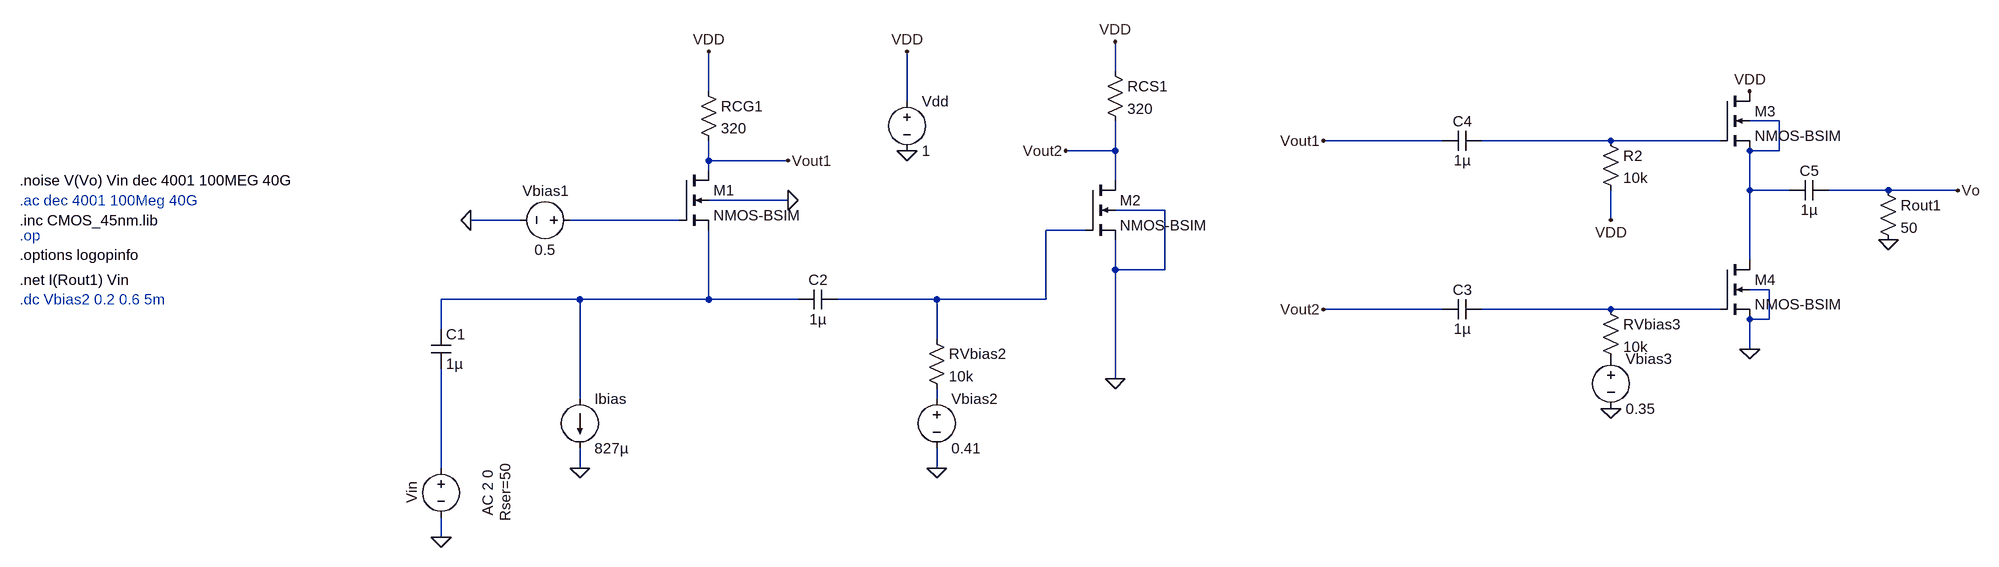
[diagram p0: schematic NMOS_45nm_N1.asc]
NMOS_45nm_N1.asc, the LTspice schematic file:
Version 4.1
SHEET 1 2016 680
WIRE 608 -224 608 -272
WIRE -48 -192 -48 -256
WIRE 272 -176 272 -256
WIRE 1680 -144 1632 -144
WIRE 1136 -112 944 -112
WIRE 1408 -112 1200 -112
WIRE 1584 -112 1408 -112
WIRE 608 -96 608 -144
WIRE 608 -96 528 -96
WIRE 1680 -96 1680 -144
WIRE 1680 -96 1632 -96
WIRE -48 -80 -48 -112
WIRE 80 -80 -48 -80
WIRE -48 -64 -48 -80
WIRE 608 -48 608 -96
WIRE 1632 -32 1632 -96
WIRE 1696 -32 1632 -32
WIRE 1856 -32 1760 -32
WIRE 1968 -32 1856 -32
WIRE 80 -16 -48 -16
WIRE 688 0 608 0
WIRE -352 16 -432 16
WIRE -96 16 -272 16
WIRE 1408 16 1408 -32
WIRE 560 32 496 32
WIRE 1632 80 1632 -32
WIRE 608 96 608 48
WIRE 688 96 688 0
WIRE 688 96 608 96
WIRE 1664 128 1632 128
WIRE -256 144 -480 144
WIRE -48 144 -48 32
WIRE -48 144 -256 144
WIRE 96 144 -48 144
WIRE 320 144 160 144
WIRE 496 144 496 32
WIRE 496 144 320 144
WIRE 1136 160 944 160
WIRE 1408 160 1200 160
WIRE 1584 160 1408 160
WIRE 1664 176 1664 128
WIRE 1664 176 1632 176
WIRE -480 192 -480 144
WIRE 320 208 320 144
WIRE 1632 224 1632 176
WIRE 608 272 608 96
WIRE -256 304 -256 144
WIRE 320 304 320 288
WIRE -480 416 -480 256
WIRE -256 416 -256 384
WIRE 320 416 320 384
WIRE -480 528 -480 496
FLAG -432 16 0
FLAG 272 -96 0
FLAG 272 -256 VDD
FLAG -48 -256 VDD
FLAG -256 416 0
FLAG 80 -16 0
FLAG -480 528 0
FLAG 80 -80 Vout1
FLAG 528 -96 Vout2
FLAG 608 272 0
FLAG 608 -272 VDD
FLAG 320 416 0
FLAG 1408 320 0
FLAG 1632 224 0
FLAG 1632 -192 VDD
FLAG 944 160 Vout2
FLAG 944 -112 Vout1
FLAG 1968 -32 Vo
FLAG 1856 48 0
FLAG 1408 16 VDD
SYMBOL voltage -256 16 R90
WINDOW 0 -32 56 VBottom 2
WINDOW 3 32 56 VTop 2
WINDOW 123 0 0 Left 0
WINDOW 39 0 0 Left 0
SYMATTR InstName Vbias1
SYMATTR Value 0.5
SYMBOL voltage 272 -192 R0
WINDOW 123 0 0 Left 0
WINDOW 39 0 0 Left 0
SYMATTR InstName Vdd
SYMATTR Value 1
SYMBOL res -64 -208 R0
SYMATTR InstName RCG1
SYMATTR Value 320
SYMBOL voltage -480 400 R0
WINDOW 0 -32 56 VBottom 2
WINDOW 3 32 56 VTop 2
WINDOW 123 60 56 VTop 2
WINDOW 39 88 56 VTop 2
SYMATTR InstName Vin
SYMATTR Value ""
SYMATTR Value2 AC 2 0
SYMATTR SpiceLine Rser=50
SYMBOL nmos4 -96 -64 R0
SYMATTR InstName M1
SYMATTR Value NMOS-BSIM
SYMATTR Value2 l=45n w=30u
SYMBOL current -256 304 R0
WINDOW 123 0 0 Left 0
WINDOW 39 0 0 Left 0
SYMATTR InstName Ibias
SYMATTR Value 827µ
SYMBOL cap -496 192 R0
SYMATTR InstName C1
SYMATTR Value 1µ
SYMBOL nmos4 560 -48 R0
SYMATTR InstName M2
SYMATTR Value NMOS-BSIM
SYMATTR Value2 l=45n w=30u
SYMBOL res 592 -240 R0
SYMATTR InstName RCS1
SYMATTR Value 320
SYMBOL cap 160 128 R90
WINDOW 0 0 32 VBottom 2
WINDOW 3 32 32 VTop 2
SYMATTR InstName C2
SYMATTR Value 1µ
SYMBOL voltage 320 288 R0
WINDOW 123 0 0 Left 0
WINDOW 39 0 0 Left 0
SYMATTR InstName Vbias2
SYMATTR Value 0.41
SYMBOL res 304 192 R0
SYMATTR InstName RVbias2
SYMATTR Value 10k
SYMBOL cap 1200 144 R90
WINDOW 0 0 32 VBottom 2
WINDOW 3 32 32 VTop 2
SYMATTR InstName C3
SYMATTR Value 1µ
SYMBOL cap 1200 -128 R90
WINDOW 0 0 32 VBottom 2
WINDOW 3 32 32 VTop 2
SYMATTR InstName C4
SYMATTR Value 1µ
SYMBOL res 1392 -128 R0
SYMATTR InstName R2
SYMATTR Value 10k
SYMBOL res 1392 144 R0
SYMATTR InstName RVbias3
SYMATTR Value 10k
SYMBOL voltage 1408 224 R0
WINDOW 123 0 0 Left 0
WINDOW 39 0 0 Left 0
SYMATTR InstName Vbias3
SYMATTR Value 0.35
SYMBOL nmos4 1584 -192 R0
SYMATTR InstName M3
SYMATTR Value NMOS-BSIM
SYMATTR Value2 l=45n w=30u
SYMBOL nmos4 1584 80 R0
SYMATTR InstName M4
SYMATTR Value NMOS-BSIM
SYMATTR Value2 l=45n w=30u
SYMBOL cap 1760 -48 R90
WINDOW 0 0 32 VBottom 2
WINDOW 3 32 32 VTop 2
SYMATTR InstName C5
SYMATTR Value 1µ
SYMBOL res 1840 -48 R0
SYMATTR InstName Rout1
SYMATTR Value 50
TEXT -1160 40 Left 2 ;.op
TEXT -1160 72 Left 2 !.options logopinfo
TEXT -1160 16 Left 2 !.inc CMOS_45nm.lib
TEXT -1160 -16 Left 2 ;.ac dec 4001 100Meg 40G
TEXT -1160 -48 Left 2 !.noise V(Vo) Vin dec 4001 100MEG 40G
TEXT -1160 112 Left 2 !.net I(Rout1) Vin
TEXT -1160 144 Left 2 ;.dc Vbias2 0.2 0.6 5m

The netlist it stands for:
* NMOS_45nm_N1.asc
Vbias1 N003 0 0.5
Vdd VDD 0 1
RCG1 VDD Vout1 320
Vin N008 0 AC 2 0 Rser=50
M1 Vout1 N003 N005 0 NMOS-BSIM l=45n w=30u
Ibias N005 0 827µ
C1 N005 N008 1µ
M2 Vout2 N004 0 0 NMOS-BSIM l=45n w=30u
RCS1 VDD Vout2 320
C2 N004 N005 1µ
Vbias2 N007 0 0.41
RVbias2 N004 N007 10k
C3 N006 Vout2 1µ
C4 N002 Vout1 1µ
R2 N002 VDD 10k
RVbias3 N006 P001 10k
Vbias3 P001 0 0.35
M3 VDD N002 N001 N001 NMOS-BSIM l=45n w=30u
M4 N001 N006 0 0 NMOS-BSIM l=45n w=30u
C5 Vo N001 1µ
Rout1 Vo 0 50
.model NMOS NMOS
.model PMOS PMOS
.lib standard.mos
* .op
.options logopinfo
.inc CMOS_45nm.lib
* .ac dec 4001 100Meg 40G
.noise V(Vo) Vin dec 4001 100MEG 40G
.net I(Rout1) Vin
* .dc Vbias2 0.2 0.6 5m
.backanno
.end